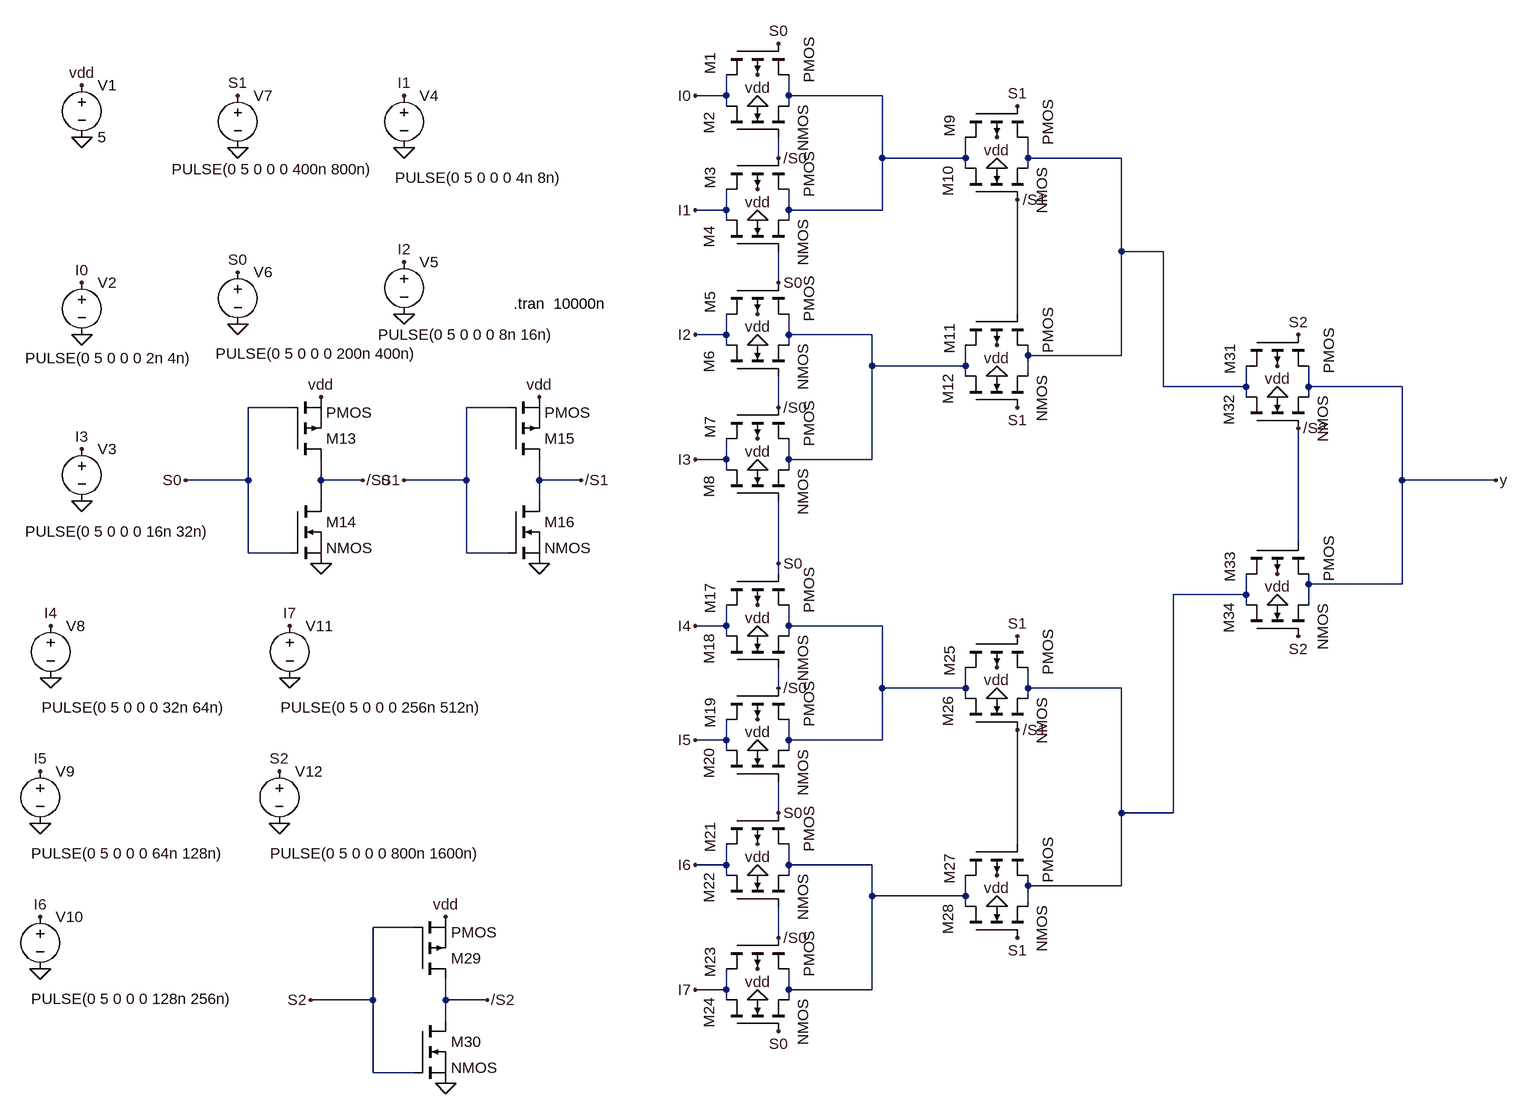
[diagram p0: schematic 8isto1.asc]
8isto1.asc, the LTspice schematic file:
Version 4
SHEET 1 1520 1388
WIRE 304 -160 304 -192
WIRE 304 -160 256 -160
WIRE 400 -160 400 -192
WIRE 544 -160 400 -160
WIRE 304 -144 304 -160
WIRE 400 -144 400 -160
WIRE 384 -64 384 -96
WIRE 544 -64 544 -160
WIRE 672 -64 672 -96
WIRE 672 -64 544 -64
WIRE 768 -64 768 -96
WIRE 912 -64 768 -64
WIRE 672 -48 672 -64
WIRE 768 -48 768 -64
WIRE 304 16 304 -16
WIRE 304 16 256 16
WIRE 400 16 400 -16
WIRE 544 16 544 -64
WIRE 544 16 400 16
WIRE 304 32 304 16
WIRE 400 32 400 16
WIRE 912 80 912 -64
WIRE 976 80 912 80
WIRE 384 128 384 80
WIRE 752 176 752 0
WIRE 304 208 304 176
WIRE 304 208 256 208
WIRE 400 208 400 176
WIRE 528 208 400 208
WIRE 304 224 304 208
WIRE 400 224 400 208
WIRE 768 240 768 224
WIRE 912 240 912 80
WIRE 912 240 768 240
WIRE 528 256 528 208
WIRE 672 256 672 224
WIRE 672 256 528 256
WIRE 672 272 672 256
WIRE 768 272 768 240
WIRE 976 288 976 80
WIRE 1104 288 1104 256
WIRE 1104 288 976 288
WIRE 1200 288 1200 256
WIRE 1344 288 1200 288
WIRE 1104 304 1104 288
WIRE 1200 304 1200 288
WIRE -368 320 -432 320
WIRE -32 320 -96 320
WIRE 384 320 384 272
WIRE 304 400 304 368
WIRE 304 400 256 400
WIRE 400 400 400 368
WIRE 528 400 528 256
WIRE 528 400 400 400
WIRE 304 416 304 400
WIRE 400 416 400 400
WIRE -432 432 -432 320
WIRE -432 432 -528 432
WIRE -320 432 -320 400
WIRE -256 432 -320 432
WIRE -96 432 -96 320
WIRE -96 432 -192 432
WIRE 16 432 16 400
WIRE 80 432 16 432
WIRE 1344 432 1344 288
WIRE 1488 432 1344 432
WIRE -320 464 -320 432
WIRE 16 464 16 432
WIRE 1184 528 1184 352
WIRE -432 544 -432 432
WIRE -368 544 -432 544
WIRE -96 544 -96 432
WIRE -32 544 -96 544
WIRE 384 560 384 464
WIRE 384 576 384 560
WIRE 1200 592 1200 576
WIRE 1344 592 1344 432
WIRE 1344 592 1200 592
WIRE 1104 608 1104 576
WIRE 1104 608 992 608
WIRE 1104 624 1104 608
WIRE 1200 624 1200 592
WIRE 304 656 304 624
WIRE 304 656 256 656
WIRE 400 656 400 624
WIRE 544 656 400 656
WIRE 304 672 304 656
WIRE 400 672 400 656
WIRE 384 752 384 720
WIRE 544 752 544 656
WIRE 672 752 672 720
WIRE 672 752 544 752
WIRE 768 752 768 720
WIRE 912 752 768 752
WIRE 672 768 672 752
WIRE 768 768 768 752
WIRE 304 832 304 800
WIRE 304 832 256 832
WIRE 400 832 400 800
WIRE 544 832 544 752
WIRE 544 832 400 832
WIRE 304 848 304 832
WIRE 400 848 400 832
WIRE 384 944 384 896
WIRE 912 944 912 752
WIRE 992 944 992 608
WIRE 992 944 912 944
WIRE 752 992 752 816
WIRE 304 1024 304 992
WIRE 304 1024 256 1024
WIRE 400 1024 400 992
WIRE 528 1024 400 1024
WIRE 304 1040 304 1024
WIRE 400 1040 400 1024
WIRE 768 1056 768 1040
WIRE 912 1056 912 944
WIRE 912 1056 768 1056
WIRE 528 1072 528 1024
WIRE 672 1072 672 1040
WIRE 672 1072 528 1072
WIRE 672 1088 672 1072
WIRE 768 1088 768 1056
WIRE -176 1120 -240 1120
WIRE 384 1136 384 1088
WIRE 304 1216 304 1184
WIRE 304 1216 256 1216
WIRE 400 1216 400 1184
WIRE 528 1216 528 1072
WIRE 528 1216 400 1216
WIRE -240 1232 -240 1120
WIRE -240 1232 -336 1232
WIRE -128 1232 -128 1200
WIRE -64 1232 -128 1232
WIRE 304 1232 304 1216
WIRE 400 1232 400 1216
WIRE -128 1264 -128 1232
WIRE -240 1344 -240 1232
WIRE -176 1344 -240 1344
FLAG -688 -176 vdd
FLAG 352 -192 vdd
FLAG -688 128 I0
FLAG -192 -160 I1
FLAG -192 96 I2
FLAG -688 384 I3
FLAG -448 112 S0
FLAG 352 -144 0
FLAG 352 -16 vdd
FLAG 352 32 0
FLAG 352 176 vdd
FLAG 352 224 0
FLAG 352 368 vdd
FLAG 352 416 0
FLAG 720 -96 vdd
FLAG 720 -48 0
FLAG 720 224 vdd
FLAG 720 272 0
FLAG -688 -96 0
FLAG -688 208 0
FLAG -688 464 0
FLAG -192 176 0
FLAG -192 -80 0
FLAG -448 -80 0
FLAG -448 192 0
FLAG -448 -160 S1
FLAG -320 304 vdd
FLAG 16 304 vdd
FLAG -192 432 S1
FLAG -528 432 S0
FLAG -256 432 /S0
FLAG 80 432 /S1
FLAG 256 -160 I0
FLAG 256 16 I1
FLAG 256 208 I2
FLAG 256 400 I3
FLAG 384 -240 S0
FLAG 384 128 S0
FLAG 384 320 /S0
FLAG 384 -64 /S0
FLAG 752 -144 S1
FLAG 752 320 S1
FLAG 752 0 /S1
FLAG -320 560 0
FLAG 16 560 0
FLAG 352 624 vdd
FLAG 352 672 0
FLAG 352 800 vdd
FLAG 352 848 0
FLAG 352 992 vdd
FLAG 352 1040 0
FLAG 352 1184 vdd
FLAG 352 1232 0
FLAG 720 720 vdd
FLAG 720 768 0
FLAG 720 1040 vdd
FLAG 720 1088 0
FLAG 256 656 I4
FLAG 256 832 I5
FLAG 256 1024 I6
FLAG 256 1216 I7
FLAG 384 1280 S0
FLAG 384 944 S0
FLAG 384 1136 /S0
FLAG 384 752 /S0
FLAG 752 672 S1
FLAG 752 1136 S1
FLAG 752 816 /S1
FLAG -736 656 I4
FLAG -736 736 0
FLAG -752 880 I5
FLAG -752 960 0
FLAG -752 1104 I6
FLAG -752 1184 0
FLAG -368 656 I7
FLAG -368 736 0
FLAG -384 880 S2
FLAG -384 960 0
FLAG -128 1104 vdd
FLAG -336 1232 S2
FLAG -64 1232 /S2
FLAG -128 1360 0
FLAG 384 560 S0
FLAG 1152 256 vdd
FLAG 1152 304 0
FLAG 1152 576 vdd
FLAG 1152 624 0
FLAG 1184 208 S2
FLAG 1184 672 S2
FLAG 1184 352 /S2
FLAG 1488 432 y
SYMBOL pmos4 304 -240 M90
WINDOW 0 14 -25 Left 2
WINDOW 3 -10 127 Left 2
SYMATTR InstName M1
SYMBOL nmos4 304 -96 R270
WINDOW 0 5 -27 Left 2
WINDOW 3 -22 118 Left 2
SYMATTR InstName M2
SYMBOL voltage -688 -192 R0
WINDOW 123 0 0 Left 0
WINDOW 39 0 0 Left 0
SYMATTR InstName V1
SYMATTR Value 5
SYMBOL voltage -688 112 R0
WINDOW 3 -87 132 Left 2
WINDOW 123 0 0 Left 0
WINDOW 39 0 0 Left 0
SYMATTR InstName V2
SYMATTR Value PULSE(0 5 0 0 0 2n 4n)
SYMBOL voltage -688 368 R0
WINDOW 3 -87 143 Left 2
WINDOW 123 0 0 Left 0
WINDOW 39 0 0 Left 0
SYMATTR InstName V3
SYMATTR Value PULSE(0 5 0 0 0 16n 32n)
SYMBOL voltage -192 -176 R0
WINDOW 3 -14 142 Left 2
WINDOW 123 0 0 Left 0
WINDOW 39 0 0 Left 0
SYMATTR InstName V4
SYMATTR Value PULSE(0 5 0 0 0 4n 8n)
SYMBOL voltage -192 80 R0
WINDOW 3 -40 128 Left 2
WINDOW 123 0 0 Left 0
WINDOW 39 0 0 Left 0
SYMATTR InstName V5
SYMATTR Value PULSE(0 5 0 0 0 8n 16n)
SYMBOL voltage -448 96 R0
WINDOW 3 -34 141 Left 2
WINDOW 123 0 0 Left 0
WINDOW 39 0 0 Left 0
SYMATTR InstName V6
SYMATTR Value PULSE(0 5 0 0 0 200n 400n)
SYMBOL voltage -448 -176 R0
WINDOW 3 -102 129 Left 2
WINDOW 123 0 0 Left 0
WINDOW 39 0 0 Left 0
SYMATTR InstName V7
SYMATTR Value PULSE(0 5 0 0 0 400n 800n)
SYMBOL pmos4 304 -64 M90
WINDOW 0 14 -25 Left 2
WINDOW 3 -10 127 Left 2
SYMATTR InstName M3
SYMBOL nmos4 304 80 R270
WINDOW 0 5 -27 Left 2
WINDOW 3 -22 118 Left 2
SYMATTR InstName M4
SYMBOL pmos4 304 128 M90
WINDOW 0 14 -25 Left 2
WINDOW 3 -10 127 Left 2
SYMATTR InstName M5
SYMBOL nmos4 304 272 R270
WINDOW 0 5 -27 Left 2
WINDOW 3 -22 118 Left 2
SYMATTR InstName M6
SYMBOL pmos4 304 320 M90
WINDOW 0 14 -25 Left 2
WINDOW 3 -10 127 Left 2
SYMATTR InstName M7
SYMBOL nmos4 304 464 R270
WINDOW 0 5 -27 Left 2
WINDOW 3 -22 118 Left 2
SYMATTR InstName M8
SYMBOL pmos4 672 -144 M90
WINDOW 0 14 -25 Left 2
WINDOW 3 -10 127 Left 2
SYMATTR InstName M9
SYMBOL nmos4 672 0 R270
WINDOW 0 5 -27 Left 2
WINDOW 3 -22 118 Left 2
SYMATTR InstName M10
SYMBOL pmos4 672 176 M90
WINDOW 0 14 -25 Left 2
WINDOW 3 -10 127 Left 2
SYMATTR InstName M11
SYMBOL nmos4 672 320 R270
WINDOW 0 5 -27 Left 2
WINDOW 3 -22 118 Left 2
SYMATTR InstName M12
SYMBOL pmos -368 400 M180
SYMATTR InstName M13
SYMBOL nmos -368 464 R0
SYMATTR InstName M14
SYMBOL pmos -32 400 M180
SYMATTR InstName M15
SYMBOL nmos -32 464 R0
SYMATTR InstName M16
SYMBOL pmos4 304 576 M90
WINDOW 0 14 -25 Left 2
WINDOW 3 -10 127 Left 2
SYMATTR InstName M17
SYMBOL nmos4 304 720 R270
WINDOW 0 5 -27 Left 2
WINDOW 3 -22 118 Left 2
SYMATTR InstName M18
SYMBOL pmos4 304 752 M90
WINDOW 0 14 -25 Left 2
WINDOW 3 -10 127 Left 2
SYMATTR InstName M19
SYMBOL nmos4 304 896 R270
WINDOW 0 5 -27 Left 2
WINDOW 3 -22 118 Left 2
SYMATTR InstName M20
SYMBOL pmos4 304 944 M90
WINDOW 0 14 -25 Left 2
WINDOW 3 -10 127 Left 2
SYMATTR InstName M21
SYMBOL nmos4 304 1088 R270
WINDOW 0 5 -27 Left 2
WINDOW 3 -22 118 Left 2
SYMATTR InstName M22
SYMBOL pmos4 304 1136 M90
WINDOW 0 14 -25 Left 2
WINDOW 3 -10 127 Left 2
SYMATTR InstName M23
SYMBOL nmos4 304 1280 R270
WINDOW 0 5 -27 Left 2
WINDOW 3 -22 118 Left 2
SYMATTR InstName M24
SYMBOL pmos4 672 672 M90
WINDOW 0 14 -25 Left 2
WINDOW 3 -10 127 Left 2
SYMATTR InstName M25
SYMBOL nmos4 672 816 R270
WINDOW 0 5 -27 Left 2
WINDOW 3 -22 118 Left 2
SYMATTR InstName M26
SYMBOL pmos4 672 992 M90
WINDOW 0 14 -25 Left 2
WINDOW 3 -10 127 Left 2
SYMATTR InstName M27
SYMBOL nmos4 672 1136 R270
WINDOW 0 5 -27 Left 2
WINDOW 3 -22 118 Left 2
SYMATTR InstName M28
SYMBOL voltage -736 640 R0
WINDOW 3 -14 142 Left 2
WINDOW 123 0 0 Left 0
WINDOW 39 0 0 Left 0
SYMATTR InstName V8
SYMATTR Value PULSE(0 5 0 0 0 32n 64n)
SYMBOL voltage -752 864 R0
WINDOW 3 -14 142 Left 2
WINDOW 123 0 0 Left 0
WINDOW 39 0 0 Left 0
SYMATTR InstName V9
SYMATTR Value PULSE(0 5 0 0 0 64n 128n)
SYMBOL voltage -752 1088 R0
WINDOW 3 -14 142 Left 2
WINDOW 123 0 0 Left 0
WINDOW 39 0 0 Left 0
SYMATTR InstName V10
SYMATTR Value PULSE(0 5 0 0 0 128n 256n)
SYMBOL voltage -368 640 R0
WINDOW 3 -14 142 Left 2
WINDOW 123 0 0 Left 0
WINDOW 39 0 0 Left 0
SYMATTR InstName V11
SYMATTR Value PULSE(0 5 0 0 0 256n 512n)
SYMBOL voltage -384 864 R0
WINDOW 3 -14 142 Left 2
WINDOW 123 0 0 Left 0
WINDOW 39 0 0 Left 0
SYMATTR InstName V12
SYMATTR Value PULSE(0 5 0 0 0 800n 1600n)
SYMBOL pmos -176 1200 M180
SYMATTR InstName M29
SYMBOL nmos -176 1264 R0
SYMATTR InstName M30
SYMBOL pmos4 1104 208 M90
WINDOW 0 14 -25 Left 2
WINDOW 3 -10 127 Left 2
SYMATTR InstName M31
SYMBOL nmos4 1104 352 R270
WINDOW 0 5 -27 Left 2
WINDOW 3 -22 118 Left 2
SYMATTR InstName M32
SYMBOL pmos4 1104 528 M90
WINDOW 0 14 -25 Left 2
WINDOW 3 -10 127 Left 2
SYMATTR InstName M33
SYMBOL nmos4 1104 672 R270
WINDOW 0 5 -27 Left 2
WINDOW 3 -22 118 Left 2
SYMATTR InstName M34
TEXT -24 160 Left 2 !.tran  10000n

The netlist it stands for:
* 8isto1.asc
M1 I0 S0 N001 vdd PMOS
M2 I0 /S0 N001 0 NMOS
V1 vdd 0 5
V2 I0 0 PULSE(0 5 0 0 0 2n 4n)
V3 I3 0 PULSE(0 5 0 0 0 16n 32n)
V4 I1 0 PULSE(0 5 0 0 0 4n 8n)
V5 I2 0 PULSE(0 5 0 0 0 8n 16n)
V6 S0 0 PULSE(0 5 0 0 0 200n 400n)
V7 S1 0 PULSE(0 5 0 0 0 400n 800n)
M3 I1 /S0 N001 vdd PMOS
M4 I1 S0 N001 0 NMOS
M5 I2 S0 N003 vdd PMOS
M6 I2 /S0 N003 0 NMOS
M7 I3 /S0 N003 vdd PMOS
M8 I3 S0 N003 0 NMOS
M9 N001 S1 N002 vdd PMOS
M10 N001 /S1 N002 0 NMOS
M11 N003 /S1 N002 vdd PMOS
M12 N003 S1 N002 0 NMOS
M13 /S0 S0 vdd vdd PMOS
M14 /S0 S0 0 0 NMOS
M15 /S1 S1 vdd vdd PMOS
M16 /S1 S1 0 0 NMOS
M17 I4 S0 N005 vdd PMOS
M18 I4 /S0 N005 0 NMOS
M19 I5 /S0 N005 vdd PMOS
M20 I5 S0 N005 0 NMOS
M21 I6 S0 N006 vdd PMOS
M22 I6 /S0 N006 0 NMOS
M23 I7 /S0 N006 vdd PMOS
M24 I7 S0 N006 0 NMOS
M25 N005 S1 N004 vdd PMOS
M26 N005 /S1 N004 0 NMOS
M27 N006 /S1 N004 vdd PMOS
M28 N006 S1 N004 0 NMOS
V8 I4 0 PULSE(0 5 0 0 0 32n 64n)
V9 I5 0 PULSE(0 5 0 0 0 64n 128n)
V10 I6 0 PULSE(0 5 0 0 0 128n 256n)
V11 I7 0 PULSE(0 5 0 0 0 256n 512n)
V12 S2 0 PULSE(0 5 0 0 0 800n 1600n)
M29 /S2 S2 vdd vdd PMOS
M30 /S2 S2 0 0 NMOS
M31 N002 S2 y vdd PMOS
M32 N002 /S2 y 0 NMOS
M33 N004 /S2 y vdd PMOS
M34 N004 S2 y 0 NMOS
.model NMOS NMOS
.model PMOS PMOS
.lib standard.mos
.tran  10000n
.backanno
.end